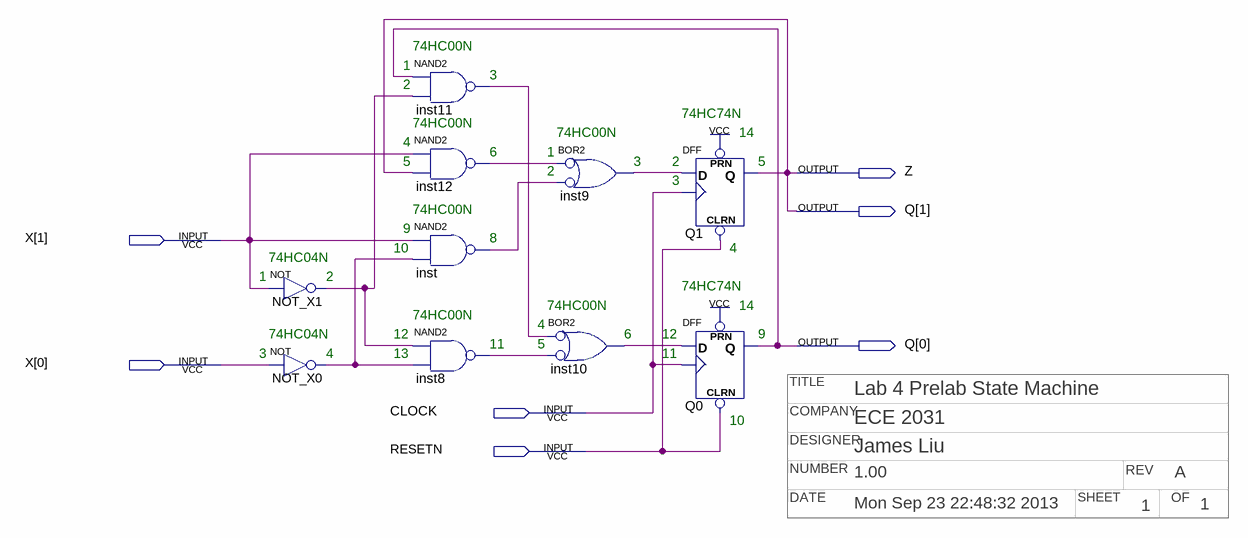
[diagram p0: schematic sheet]
// Quartus schematic lab4.bdf as structural Verilog: 10 symbols, 7 pins
// Title block: TITLE: Lab 4 Prelab State Machine; COMPANY: ECE 2031; DESIGNER: James Liu; NUMBER: 1.00; REV: A; DATE: Mon Sep 23 22:48:32 2013; SHEET: 1; OF: 1
module lab4 (
  input  [1:0] X,
  input  CLOCK,
  input  RESETN,
  output Z,
  output [1:0] Q
);

  wire inst8_out, inst9_out, inst10_out, inst11_out, inst12_out, inst_out, NOT_X0_out, NOT_X1_out;

  not NOT_X1 (NOT_X1_out, X[1]);
  not NOT_X0 (NOT_X0_out, X[0]);
  nand inst11 (inst11_out, Q[0], NOT_X1_out);
  nand inst12 (inst12_out, X[1], Q[1]);
  nand inst (inst_out, X[1], NOT_X0_out);
  nand inst8 (inst8_out, NOT_X1_out, NOT_X0_out);
  or inst9 (inst9_out, ~inst12_out, ~inst_out);  // BOR2
  or inst10 (inst10_out, ~inst11_out, ~inst8_out);  // BOR2
  DFF Q1 (.CLRN(RESETN), .CLK(CLOCK), .D(inst9_out), .PRN(1'b1), .Q(Q[1]));
  DFF Q0 (.CLRN(RESETN), .CLK(CLOCK), .D(inst10_out), .PRN(1'b1), .Q(Q[0]));

  assign Z = Q[1];

  // Notes on the sheet:
  //   74HC00N
  //   1
  //   3
  //   2
  //   74HC74N
  //   74HC00N
  //   74HC00N
  //   14
  //   4
  //   6
  //   1
  //   5
  //   3
  //   2
  //   5
  //   2
  //   3
  //   74HC00N
  //   9
  //   8
  //   10
  //   4
  //   74HC04N
  //   1
  //   2
  //   74HC74N
  //   74HC00N
  //   14
  //   74HC00N
  //   4
  //   74HC04N
  //   12
  //   6
  //   12
  //   9
  //   11
  //   5
  //   3
  //   4
  //   13
  //   11
  //   10
endmodule
